# EAGLE schematic LKS2024_ESP_ACController_v66 (EAGLE 9.7.0)

## Sheet 1 of 5
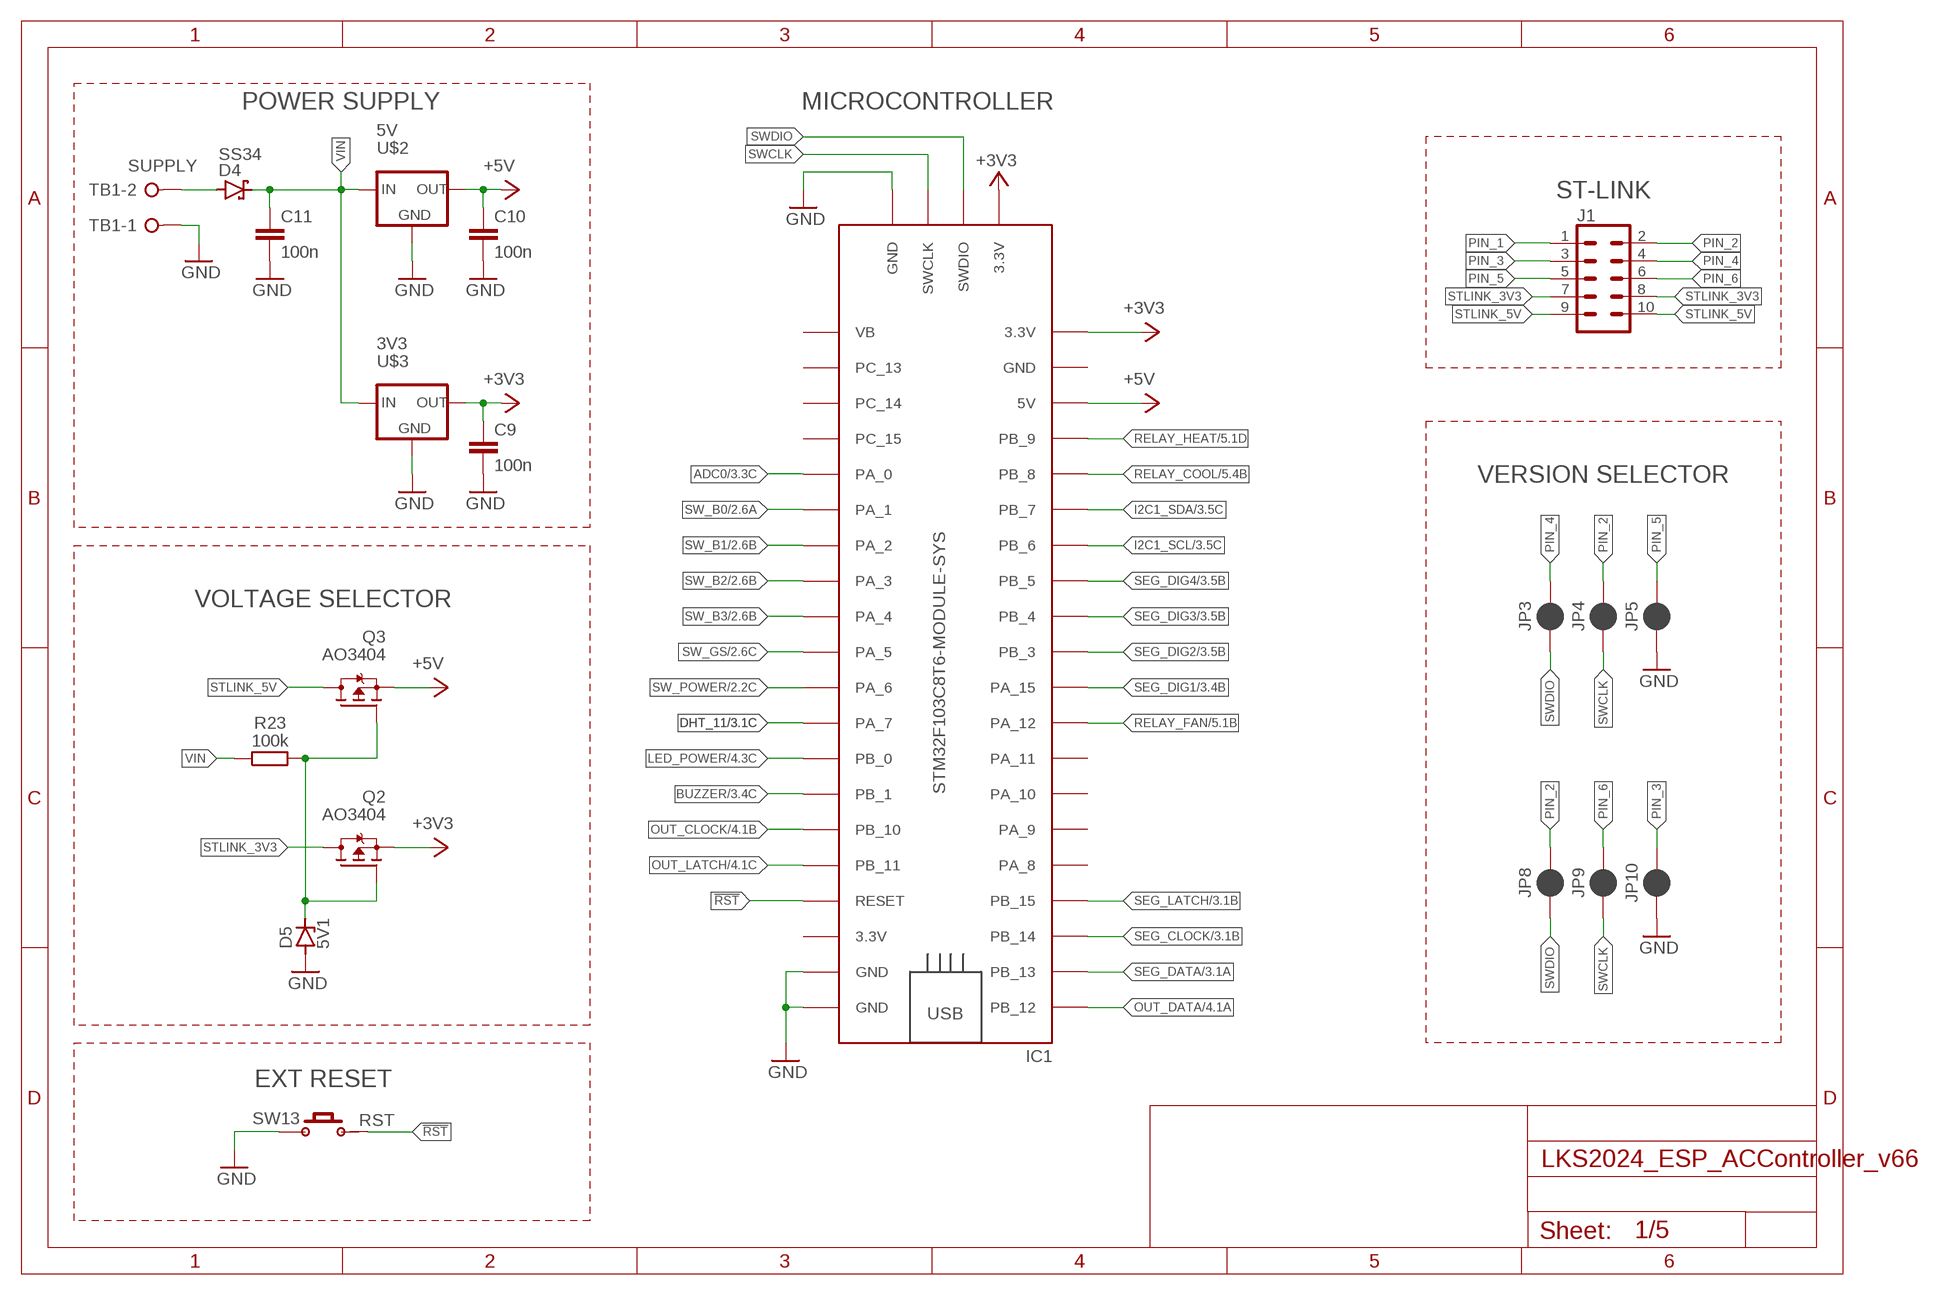
[diagram p0: schematic, sheet 1]

### Parts
C9  100n  C-EUC0805  [C0805]
C10  100n  C-EUC0805  [C0805]
C11  100n  C-EUC0805  [C0805]
D4  SS34  SS34SMA  [SMA]
D5  5V1  ZENER-DIODESOD80C  [SOD80C]
IC1  STM32F103C8T6-MODULE-SYS  [STM32F103C8T6-MODULE-SYS]
J1  CONN_05X2ML10L  [ML10L]
JP3  JUMPER-SMT_2_NC_PASTE_SILK  [SMT-JUMPER_2_NC_PASTE_SILK]
JP4  JUMPER-SMT_2_NC_PASTE_SILK  [SMT-JUMPER_2_NC_PASTE_SILK]
JP5  JUMPER-SMT_2_NC_PASTE_SILK  [SMT-JUMPER_2_NC_PASTE_SILK]
JP8  JUMPER-SMT_2_NC_PASTE_SILK  [SMT-JUMPER_2_NC_PASTE_SILK]
JP9  JUMPER-SMT_2_NC_PASTE_SILK  [SMT-JUMPER_2_NC_PASTE_SILK]
JP10  JUMPER-SMT_2_NC_PASTE_SILK  [SMT-JUMPER_2_NC_PASTE_SILK]
Q2  AO3404  [SOT23]
Q3  AO3404  [SOT23]
R23  100k  R-EU_R0805  [R0805]
SW13  RST  PUSH_BUTTON2P  [PUSH_BUTTON_2P]
TB1  SUPPLY  TERMINAL-BLOK-90  [MSTBA2]
U$2  5V  V_REG_LD1117VXXLD1117-SMD  [SOT223]
U$3  3V3  V_REG_LD1117VXXLD1117-SMD  [SOT223]

### Nets
!RST: IC1.RESET SW13.2
+3V3: C9.1 IC1.3.3V_1(3.3V) IC1.3V3_1(3.3V) IC1.3V3_3(3.3V) Q2.2(S) U$3.2(OUT) ; also sheet 2,3
+5V: C10.1 IC1.5V Q3.2(S) U$2.2(OUT) ; also sheet 3,4,5
ADC0: IC1.PA_0 ; also sheet 3
BUZZER: IC1.PB_1 ; also sheet 3
DHT_11: IC1.PA_7 ; also sheet 3
GND: C9.2 C10.2 C11.2 D5.A IC1.GND_2(GND) IC1.GND_3(GND) IC1.GND_4(GND) IC1.GND_5(GND) JP5.1 JP10.1 SW13.1 TB1.1 U$2.1(GND) U$3.1(GND) ; also sheet 2,3,4,5
I2C1_SCL: IC1.PB_6 ; also sheet 3
I2C1_SDA: IC1.PB_7 ; also sheet 3
LED_POWER: IC1.PB_0 ; also sheet 4
N$54: D4.A TB1.2
N$55: D5.C Q2.1(G) Q3.1(G) R23.2
OUT_CLOCK: IC1.PB_10 ; also sheet 4
OUT_DATA: IC1.PB_12 ; also sheet 4
OUT_LATCH: IC1.PB_11 ; also sheet 4
PIN_1: J1.1
PIN_2: J1.2 JP4.2 JP8.2
PIN_3: J1.3 JP10.2
PIN_4: J1.4 JP3.2
PIN_5: J1.5 JP5.2
PIN_6: J1.6 JP9.2
RELAY_COOL: IC1.PB_8 ; also sheet 5
RELAY_FAN: IC1.PA_12 ; also sheet 5
RELAY_HEAT: IC1.PB_9 ; also sheet 5
SEG_CLOCK: IC1.PB_14 ; also sheet 3
SEG_DATA: IC1.PB_13 ; also sheet 3
SEG_DIG1: IC1.PA_15 ; also sheet 3
SEG_DIG2: IC1.PB_3 ; also sheet 3
SEG_DIG3: IC1.PB_4 ; also sheet 3
SEG_DIG4: IC1.PB_5 ; also sheet 3
SEG_LATCH: IC1.PB_15 ; also sheet 3
STLINK_3V3: J1.7 J1.8 Q2.3(D)
STLINK_5V: J1.9 J1.10 Q3.3(D)
SW_B0: IC1.PA_1 ; also sheet 2
SW_B1: IC1.PA_2 ; also sheet 2
SW_B2: IC1.PA_3 ; also sheet 2
SW_B3: IC1.PA_4 ; also sheet 2
SW_GS: IC1.PA_5 ; also sheet 2
SW_POWER: IC1.PA_6 ; also sheet 2
SWCLK: IC1.SWCLK IC1.SWCLK1(SWCLK) JP4.1 JP9.1
SWDIO: IC1.SWDIO IC1.SWDIO1(SWDIO) JP3.1 JP8.1
VIN: C11.1 D4.C R23.1 U$2.3(IN) U$3.3(IN)
Unconnected: IC1.3.3V_2(3.3V) IC1.GND_1(GND) IC1.PA_8 IC1.PA_9 IC1.PA_10 IC1.PA_11 IC1.PC_13 IC1.PC_14 IC1.PC_15 IC1.VB

### Notes on the sheet
- POWER SUPPLY | MICROCONTROLLER
- ST-LINK
- VERSION SELECTOR
- VOLTAGE SELECTOR
- EXT RESET

## Sheet 2 of 5
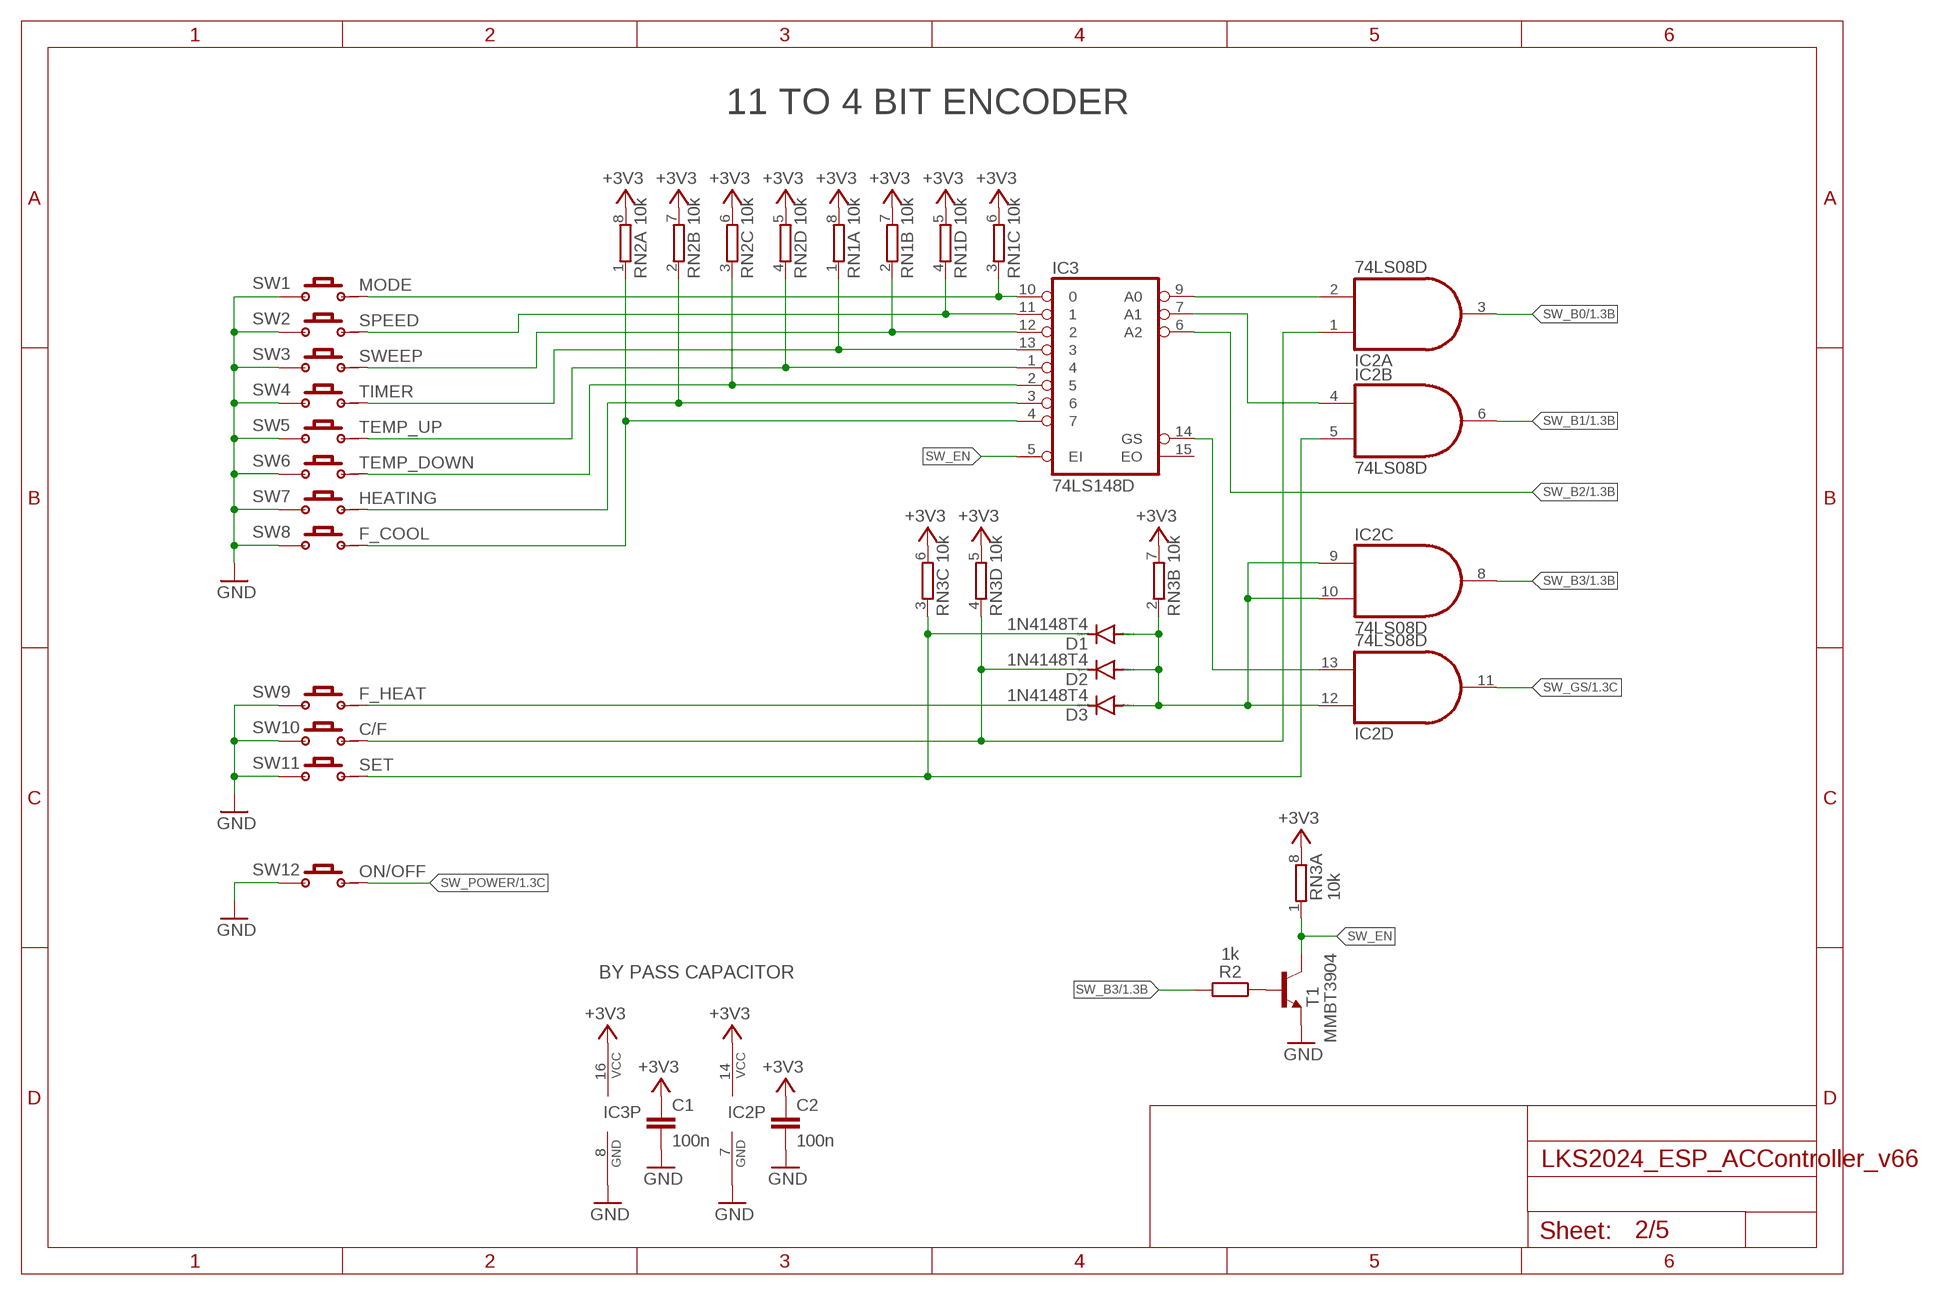
[diagram p1: schematic, sheet 2]

### Parts
C1  100n  C-EUC0805  [C0805]
C2  100n  C-EUC0805  [C0805]
D1  1N4148T4  [SOD123]
D2  1N4148T4  [SOD123]
D3  1N4148T4  [SOD123]
IC2  74LS08D  [SO14]
IC3  74LS148D  [SO16]
R2  1k  R-EU_R0805  [R0805]
RN1  10k  4R-N0603-ARC  [0603-ARC]
RN2  10k  4R-N0603-ARC  [0603-ARC]
RN3  10k  4R-N0603-ARC  [0603-ARC]
SW1  MODE  PUSH_BUTTON2P  [PUSH_BUTTON_2P]
SW2  SPEED  PUSH_BUTTON2P  [PUSH_BUTTON_2P]
SW3  SWEEP  PUSH_BUTTON2P  [PUSH_BUTTON_2P]
SW4  TIMER  PUSH_BUTTON2P  [PUSH_BUTTON_2P]
SW5  TEMP_UP  PUSH_BUTTON2P  [PUSH_BUTTON_2P]
SW6  TEMP_DOWN  PUSH_BUTTON2P  [PUSH_BUTTON_2P]
SW7  HEATING  PUSH_BUTTON2P  [PUSH_BUTTON_2P]
SW8  F_COOL  PUSH_BUTTON2P  [PUSH_BUTTON_2P]
SW9  F_HEAT  PUSH_BUTTON2P  [PUSH_BUTTON_2P]
SW10  C/F  PUSH_BUTTON2P  [PUSH_BUTTON_2P]
SW11  SET  PUSH_BUTTON2P  [PUSH_BUTTON_2P]
SW12  ON/OFF  PUSH_BUTTON2P  [PUSH_BUTTON_2P]
T1  MMBT3904  MMBT3904SOT23-BEC  [SOT23-BEC]

### Nets
+3V3: C1.1 C2.1 IC2.14(P:VCC) IC3.16(VCC) RN1.5 RN1.6 RN1.7 RN1.8 RN2.5 RN2.6 RN2.7 RN2.8 RN3.5 RN3.6 RN3.7 RN3.8 ; also sheet 1,3
GND: C1.2 C2.2 IC2.7(P:GND) IC3.8(GND) SW1.1 SW2.1 SW3.1 SW4.1 SW5.1 SW6.1 SW7.1 SW8.1 SW9.1 SW10.1 SW11.1 SW12.1 T1.E ; also sheet 1,3,4,5
N$1: IC2.2(A:I1) IC3.9(A0)
N$2: IC2.4(B:I0) IC3.7(A1)
N$3: IC2.13(D:I1) IC3.14(GS)
N$4: D1.A D2.A D3.A IC2.9(C:I0) IC2.10(C:I1) IC2.12(D:I0) RN3.2
N$5: IC3.10 RN1.3 SW1.2
N$6: IC3.11 RN1.4 SW2.2
N$7: IC3.12 RN1.2 SW3.2
N$8: IC3.13 RN1.1 SW4.2
N$9: IC3.1 RN2.4 SW5.2
N$10: IC3.2 RN2.3 SW6.2
N$11: IC3.3 RN2.2 SW7.2
N$12: IC3.4 RN2.1 SW8.2
N$13: D3.C SW9.2
N$14: D2.C IC2.1(A:I0) RN3.4 SW10.2
N$15: D1.C IC2.5(B:I1) RN3.3 SW11.2
N$17: R2.1 T1.B
SW_B0: IC2.3(A:O) ; also sheet 1
SW_B1: IC2.6(B:O) ; also sheet 1
SW_B2: IC3.6(A2) ; also sheet 1
SW_B3: IC2.8(C:O) R2.2 ; also sheet 1
SW_EN: IC3.5(EI) RN3.1 T1.C
SW_GS: IC2.11(D:O) ; also sheet 1
SW_POWER: SW12.2 ; also sheet 1
Unconnected: IC3.15(EO)

### Notes on the sheet
- 11 TO 4 BIT ENCODER
- BY PASS CAPACITOR

## Sheet 3 of 5
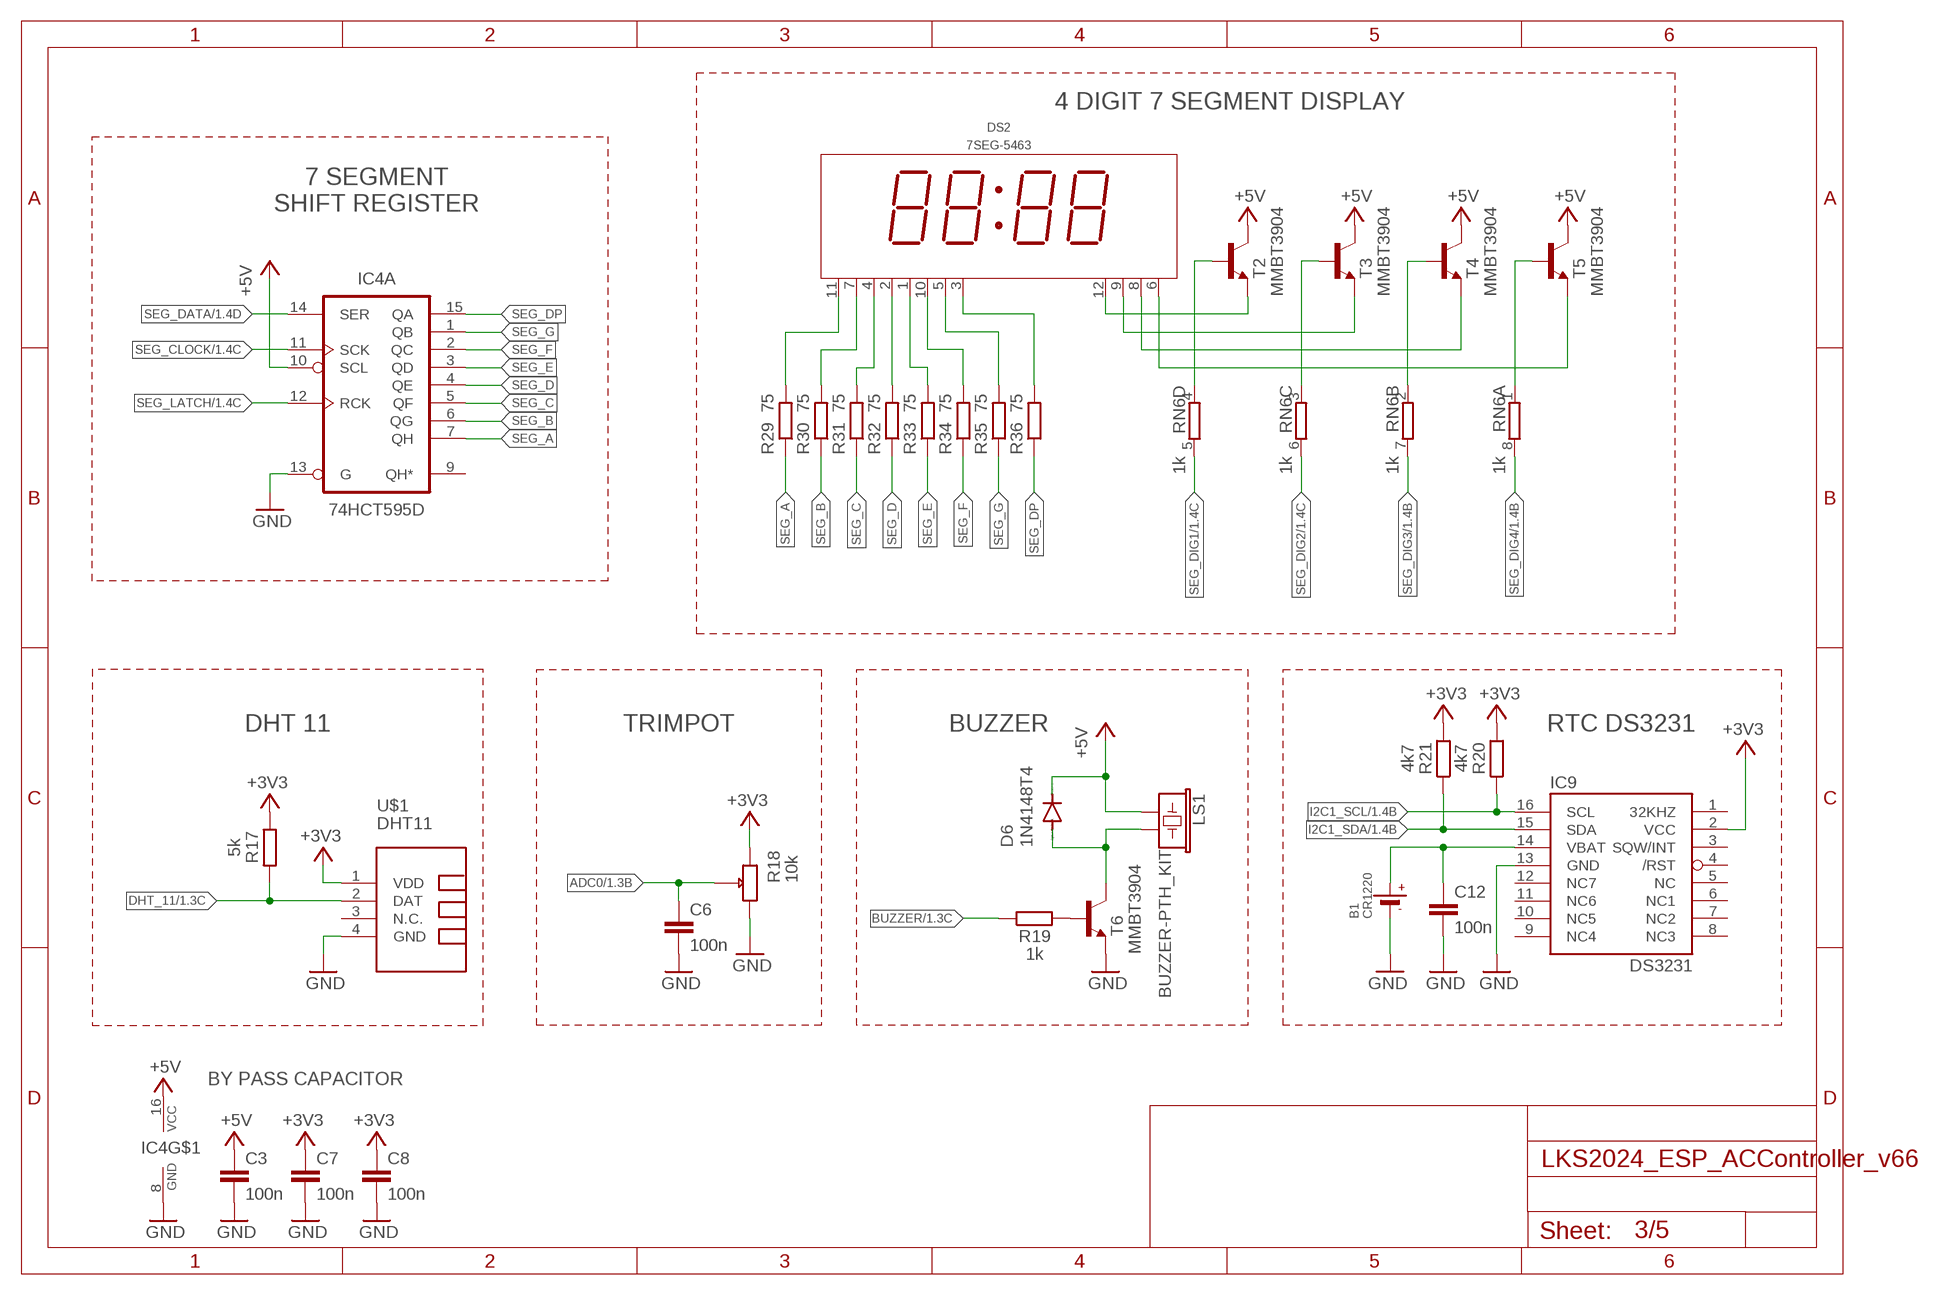
[diagram p2: schematic, sheet 3]

### Parts
B1  CR1220  BATTERY  [CR1220]
C3  100n  C-EUC0805  [C0805]
C6  100n  C-EUC0805  [C0805]
C7  100n  C-EUC0805  [C0805]
C8  100n  C-EUC0805  [C0805]
C12  100n  C-EUC0805  [C0805]
D6  1N4148T4  [SOD123]
DS2  7SEG-5463  [5643]
IC4  74HCT595D  [SO16]
IC9  DS3231"  [SO16W]
LS1  BUZZER-PTH_KIT  [BUZZER-12MM-KIT]
R17  5k  R-EU_R0805  [R0805]
R18  10k  3386P-1-101T  [TRIM_3386P-1-101T]
R19  1k  R-EU_R0805  [R0805]
R20  4k7  R-EU_R0805  [R0805]
R21  4k7  R-EU_R0805  [R0805]
R29  75  R-EU_R0603  [R0603]
R30  75  R-EU_R0603  [R0603]
R31  75  R-EU_R0603  [R0603]
R32  75  R-EU_R0603  [R0603]
R33  75  R-EU_R0603  [R0603]
R34  75  R-EU_R0603  [R0603]
R35  75  R-EU_R0603  [R0603]
R36  75  R-EU_R0603  [R0603]
RN6  1k  4R-N0603-ARC  [0603-ARC]
T2  MMBT3904  MMBT3904SOT23-BEC  [SOT23-BEC]
T3  MMBT3904  MMBT3904SOT23-BEC  [SOT23-BEC]
T4  MMBT3904  MMBT3904SOT23-BEC  [SOT23-BEC]
T5  MMBT3904  MMBT3904SOT23-BEC  [SOT23-BEC]
T6  MMBT3904  MMBT3904SOT23-BEC  [SOT23-BEC]
U$1  DHT11  TEMP-HUM-SENSOR-DHT11H  [DHT11]

### Nets
+3V3: C7.1 C8.1 IC9.2(VCC) R17.1 R18.3(CW) R20.2 R21.2 U$1.1(VDD) ; also sheet 1,2
+5V: C3.1 D6.C IC4.10(A:SCL) IC4.16(VCC) LS1.+\ T2.C T3.C T4.C T5.C ; also sheet 1,4,5
ADC0: C6.1 R18.2(WIPER) ; also sheet 1
BUZZER: R19.1 ; also sheet 1
DHT_11: R17.2 U$1.2(DAT) ; also sheet 1
GND: B1.- C3.2 C6.2 C7.2 C8.2 C12.2 IC4.8(GND) IC4.13(A:G) IC9.13(GND) R18.1(CCW) T6.E U$1.4(GND) ; also sheet 1,2,4,5
I2C1_SCL: IC9.16(SCL) R20.1 ; also sheet 1
I2C1_SDA: IC9.15(SDA) R21.1 ; also sheet 1
N$18: DS2.12(DIG1) T2.E
N$19: DS2.11(A) R29.2
N$20: DS2.7(B) R30.2
N$21: DS2.4(C) R31.2
N$22: DS2.2(D) R32.2
N$23: DS2.1(E) R33.2
N$24: DS2.10(F) R34.2
N$25: DS2.5(G) R35.2
N$26: DS2.3(H) R36.2
N$27: RN6.4 T2.B
N$28: DS2.9(DIG2) T3.E
N$29: DS2.8(DIG3) T4.E
N$30: DS2.6(DIG4) T5.E
N$31: RN6.3 T3.B
N$32: RN6.2 T4.B
N$33: RN6.1 T5.B
N$50: D6.A LS1.- T6.C
N$51: R19.2 T6.B
N$52: B1.+ C12.1 IC9.14(VBAT)
SEG_A: IC4.7(A:QH) R29.1
SEG_B: IC4.6(A:QG) R30.1
SEG_C: IC4.5(A:QF) R31.1
SEG_CLOCK: IC4.11(A:SCK) ; also sheet 1
SEG_D: IC4.4(A:QE) R32.1
SEG_DATA: IC4.14(A:SER) ; also sheet 1
SEG_DIG1: RN6.5 ; also sheet 1
SEG_DIG2: RN6.6 ; also sheet 1
SEG_DIG3: RN6.7 ; also sheet 1
SEG_DIG4: RN6.8 ; also sheet 1
SEG_DP: IC4.15(A:QA) R36.1
SEG_E: IC4.3(A:QD) R33.1
SEG_F: IC4.2(A:QC) R34.1
SEG_G: IC4.1(A:QB) R35.1
SEG_LATCH: IC4.12(A:RCK) ; also sheet 1
Unconnected: IC4.9(A:QH*) IC9.1(32KHZ) IC9.3(SQW/INT) IC9.4(/RST) IC9.5(NC) IC9.6(NC1) IC9.7(NC2) IC9.8(NC3) IC9.9(NC4) IC9.10(NC5) IC9.11(NC6) IC9.12(NC7) U$1.3(N.C.)

### Notes on the sheet
- 4 DIGIT 7 SEGMENT DISPLAY
- 7 SEGMENT
  SHIFT REGISTER
- DHT 11 | TRIMPOT | BUZZER | RTC DS3231
- BY PASS CAPACITOR

## Sheet 4 of 5
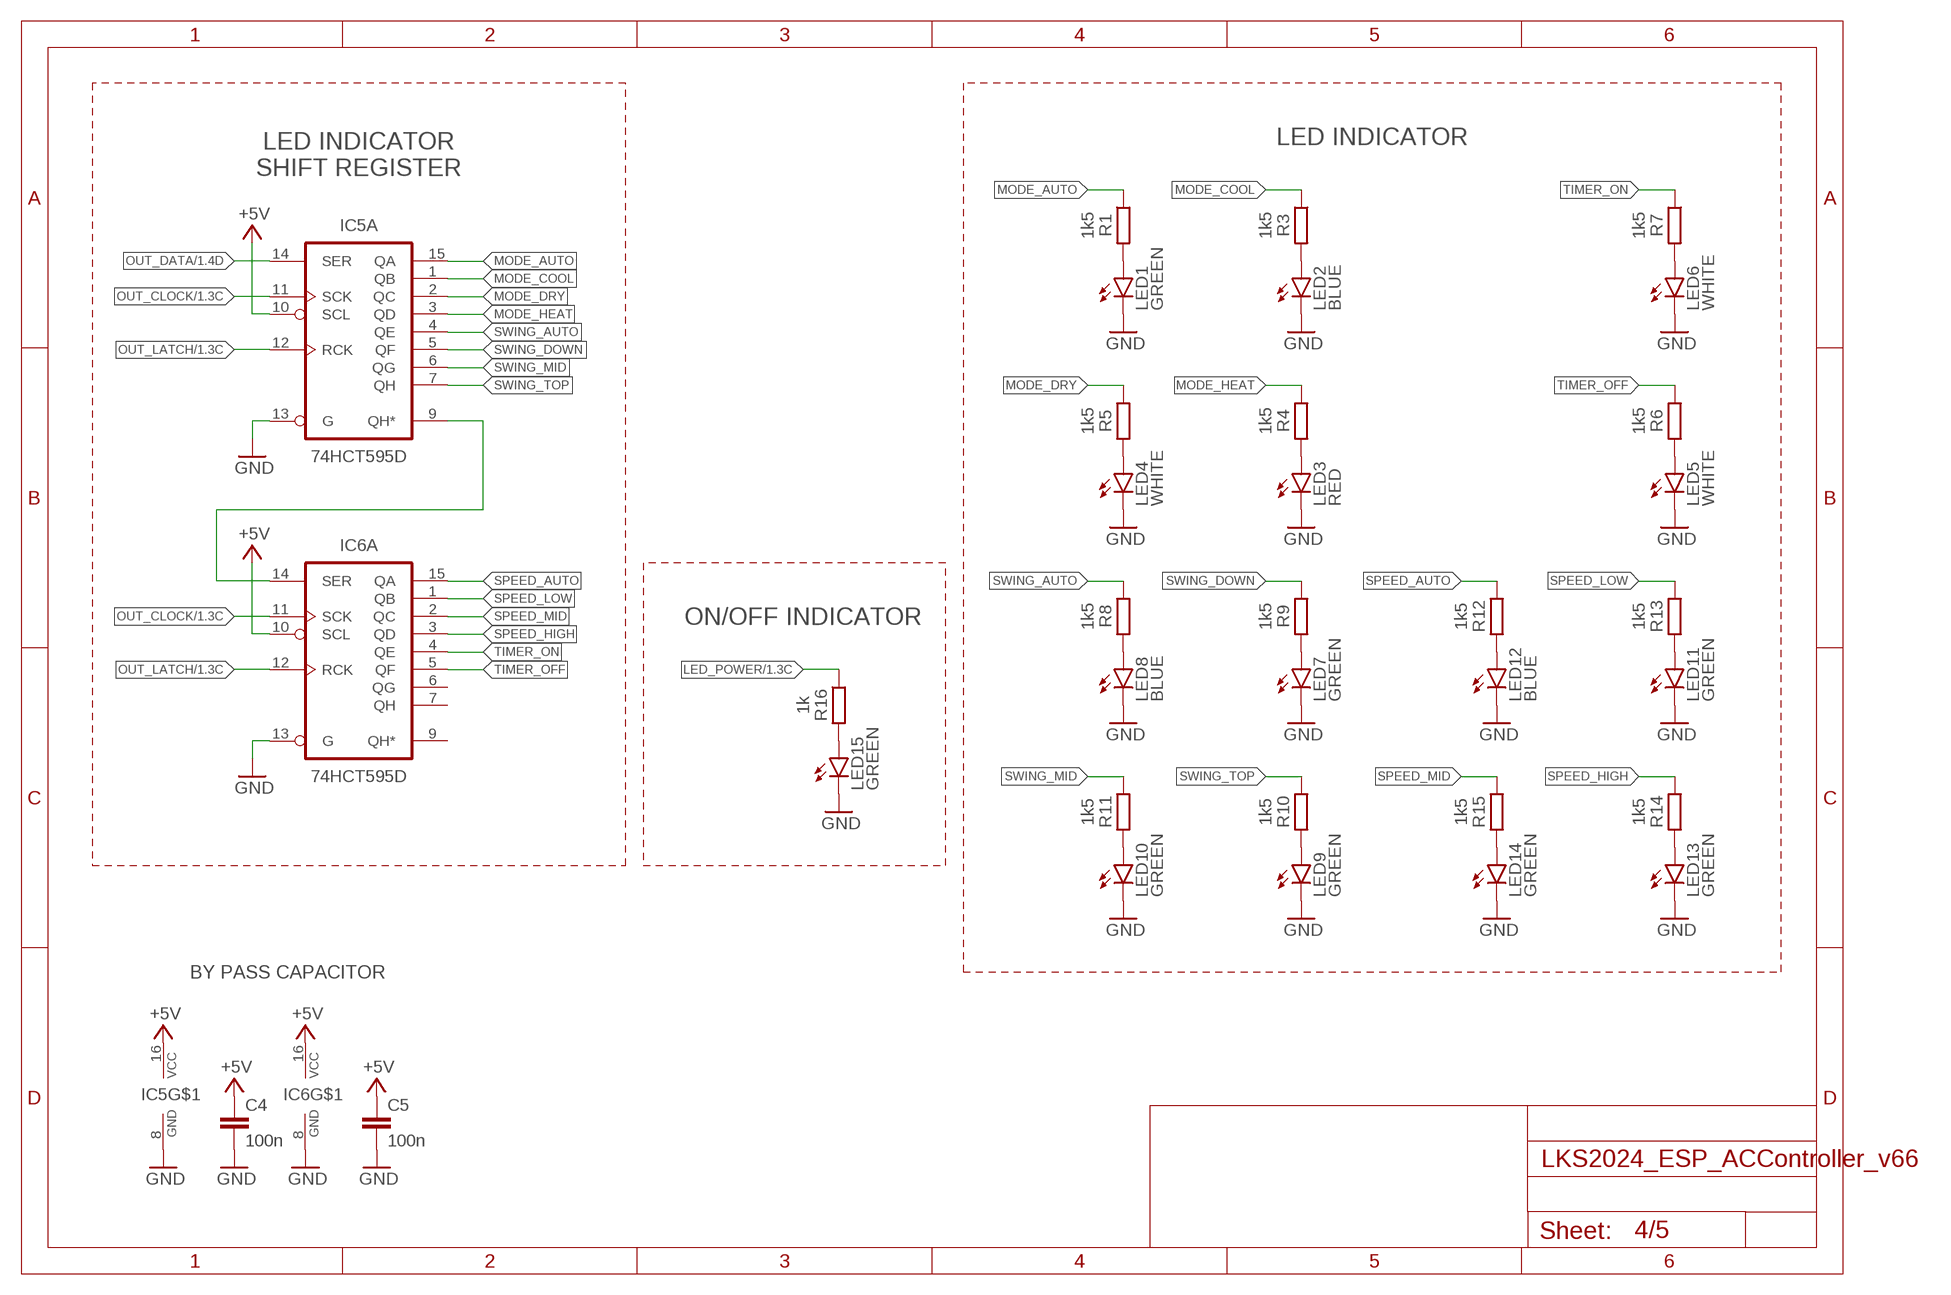
[diagram p3: schematic, sheet 4]

### Parts
C4  100n  C-EUC0805  [C0805]
C5  100n  C-EUC0805  [C0805]
IC5  74HCT595D  [SO16]
IC6  74HCT595D  [SO16]
LED1  GREEN  LEDCHIPLED_1206  [CHIPLED_1206]
LED2  BLUE  LEDCHIPLED_1206  [CHIPLED_1206]
LED3  RED  LEDCHIPLED_1206  [CHIPLED_1206]
LED4  WHITE  LEDCHIPLED_1206  [CHIPLED_1206]
LED5  WHITE  LEDCHIPLED_1206  [CHIPLED_1206]
LED6  WHITE  LEDCHIPLED_1206  [CHIPLED_1206]
LED7  GREEN  LEDCHIPLED_1206  [CHIPLED_1206]
LED8  BLUE  LEDCHIPLED_1206  [CHIPLED_1206]
LED9  GREEN  LEDCHIPLED_1206  [CHIPLED_1206]
LED10  GREEN  LEDCHIPLED_1206  [CHIPLED_1206]
LED11  GREEN  LEDCHIPLED_1206  [CHIPLED_1206]
LED12  BLUE  LEDCHIPLED_1206  [CHIPLED_1206]
LED13  GREEN  LEDCHIPLED_1206  [CHIPLED_1206]
LED14  GREEN  LEDCHIPLED_1206  [CHIPLED_1206]
LED15  GREEN  LEDCHIPLED_1206  [CHIPLED_1206]
R1  1k5  R-EU_R0805  [R0805]
R3  1k5  R-EU_R0805  [R0805]
R4  1k5  R-EU_R0805  [R0805]
R5  1k5  R-EU_R0805  [R0805]
R6  1k5  R-EU_R0805  [R0805]
R7  1k5  R-EU_R0805  [R0805]
R8  1k5  R-EU_R0805  [R0805]
R9  1k5  R-EU_R0805  [R0805]
R10  1k5  R-EU_R0805  [R0805]
R11  1k5  R-EU_R0805  [R0805]
R12  1k5  R-EU_R0805  [R0805]
R13  1k5  R-EU_R0805  [R0805]
R14  1k5  R-EU_R0805  [R0805]
R15  1k5  R-EU_R0805  [R0805]
R16  1k  R-EU_R0805  [R0805]

### Nets
+5V: C4.1 C5.1 IC5.10(A:SCL) IC5.16(VCC) IC6.10(A:SCL) IC6.16(VCC) ; also sheet 1,3,5
GND: C4.2 C5.2 IC5.8(GND) IC5.13(A:G) IC6.8(GND) IC6.13(A:G) LED1.C LED2.C LED3.C LED4.C LED5.C LED6.C LED7.C LED8.C LED9.C LED10.C LED11.C LED12.C LED13.C LED14.C LED15.C ; also sheet 1,2,3,5
LED_POWER: R16.1 ; also sheet 1
MODE_AUTO: IC5.15(A:QA) R1.1
MODE_COOL: IC5.1(A:QB) R3.1
MODE_DRY: IC5.2(A:QC) R5.1
MODE_HEAT: IC5.3(A:QD) R4.1
N$34: IC5.9(A:QH*) IC6.14(A:SER)
N$35: LED1.A R1.2
N$36: LED2.A R3.2
N$37: LED3.A R4.2
N$38: LED4.A R5.2
N$39: LED5.A R6.2
N$40: LED6.A R7.2
N$41: LED8.A R8.2
N$42: LED7.A R9.2
N$43: LED9.A R10.2
N$44: LED10.A R11.2
N$45: LED12.A R12.2
N$46: LED11.A R13.2
N$47: LED13.A R14.2
N$48: LED14.A R15.2
N$49: LED15.A R16.2
OUT_CLOCK: IC5.11(A:SCK) IC6.11(A:SCK) ; also sheet 1
OUT_DATA: IC5.14(A:SER) ; also sheet 1
OUT_LATCH: IC5.12(A:RCK) IC6.12(A:RCK) ; also sheet 1
SPEED_AUTO: IC6.15(A:QA) R12.1
SPEED_HIGH: IC6.3(A:QD) R14.1
SPEED_LOW: IC6.1(A:QB) R13.1
SPEED_MID: IC6.2(A:QC) R15.1
SWING_AUTO: IC5.4(A:QE) R8.1
SWING_DOWN: IC5.5(A:QF) R9.1
SWING_MID: IC5.6(A:QG) R11.1
SWING_TOP: IC5.7(A:QH) R10.1
TIMER_OFF: IC6.5(A:QF) R6.1
TIMER_ON: IC6.4(A:QE) R7.1
Unconnected: IC6.6(A:QG) IC6.7(A:QH) IC6.9(A:QH*)

### Notes on the sheet
- LED INDICATOR
- LED INDICATOR
  SHIFT REGISTER
- ON/OFF INDICATOR
- BY PASS CAPACITOR

## Sheet 5 of 5
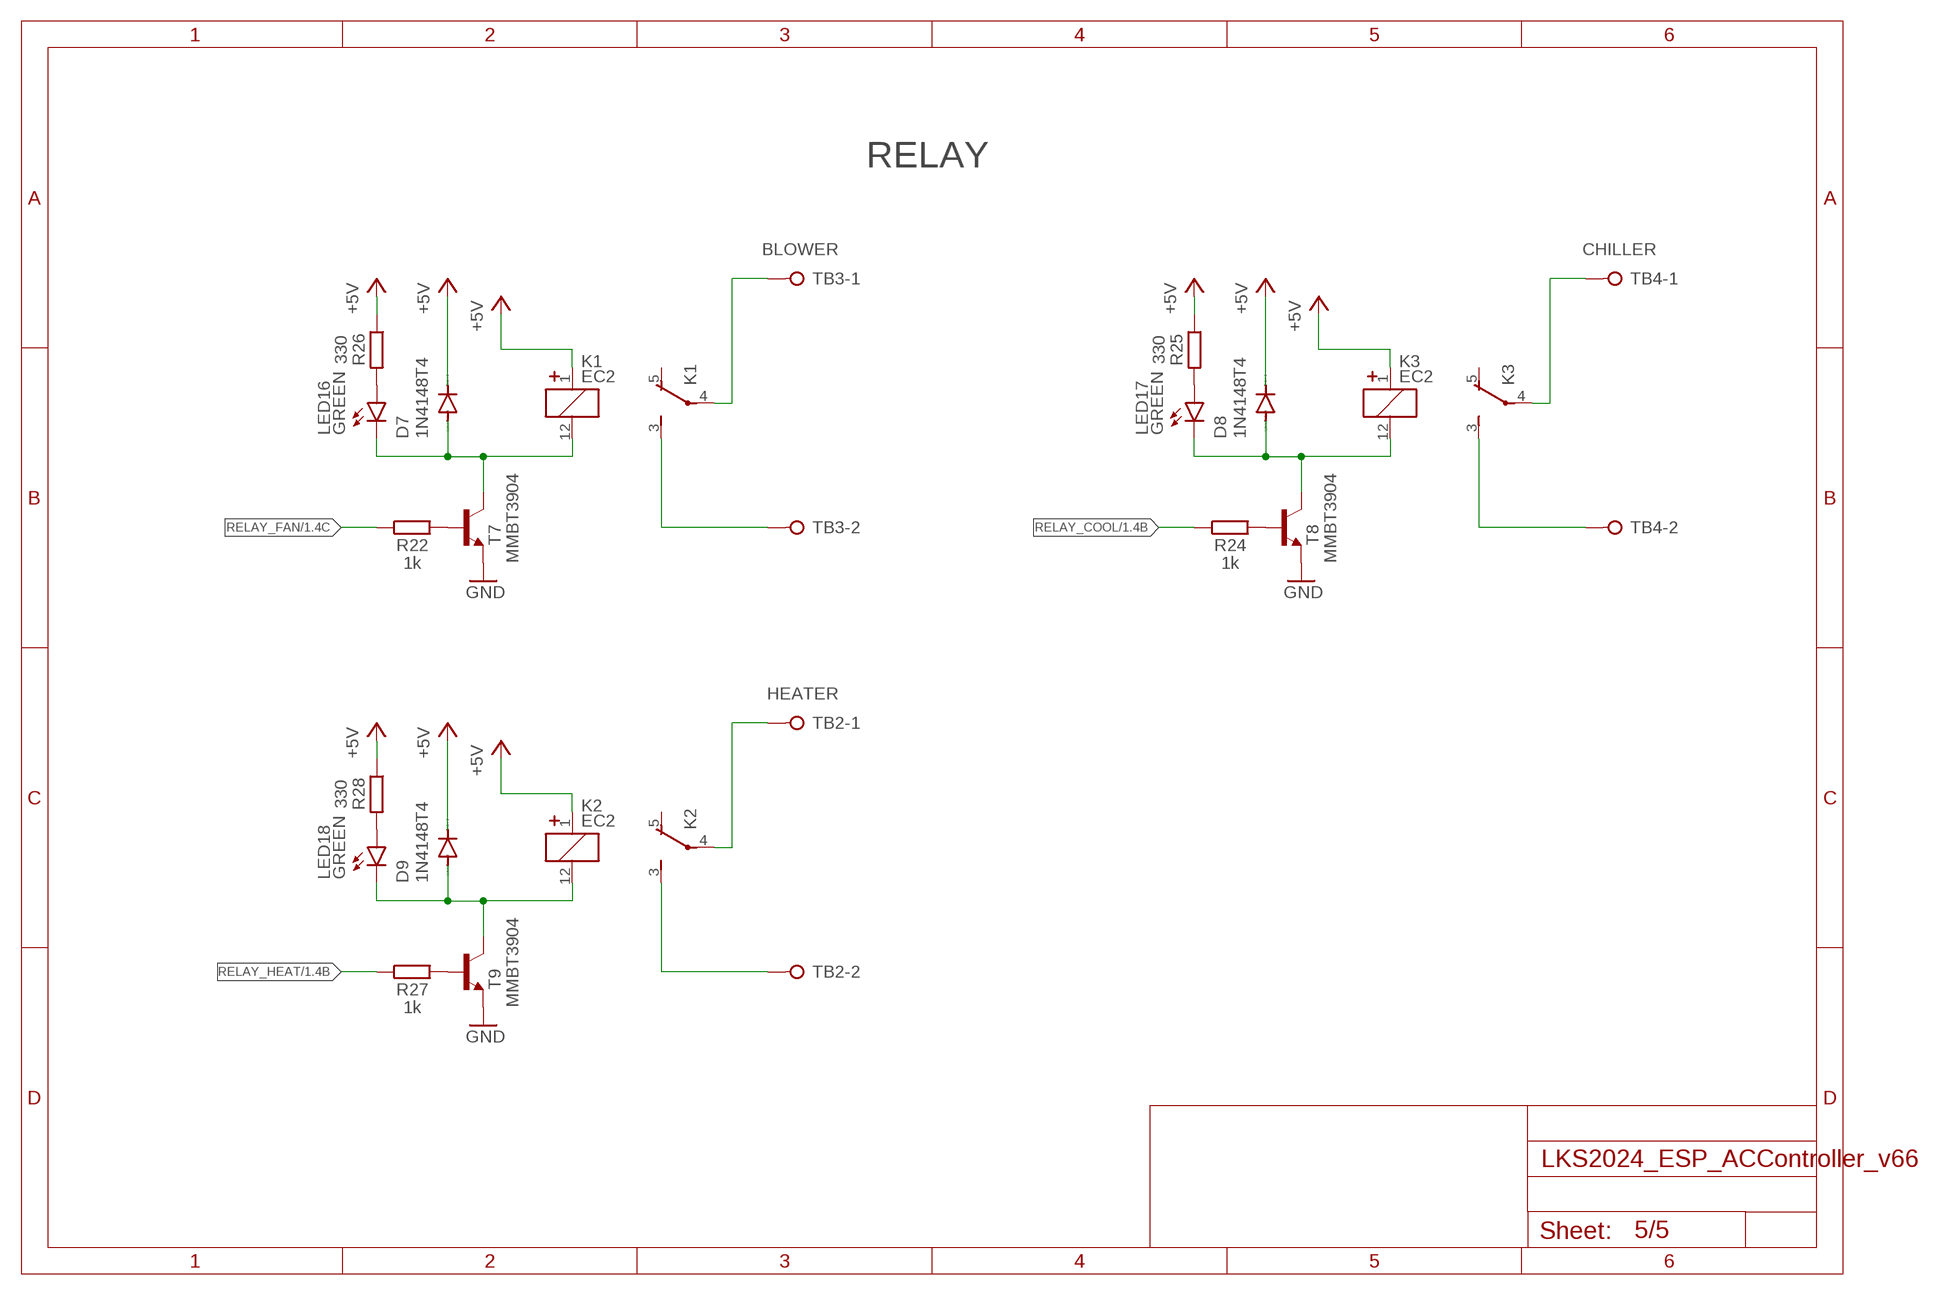
[diagram p4: schematic, sheet 5]

### Parts
D7  1N4148T4  [SOD123]
D8  1N4148T4  [SOD123]
D9  1N4148T4  [SOD123]
K1  EC2  [EC2]
K2  EC2  [EC2]
K3  EC2  [EC2]
LED16  GREEN  LEDCHIPLED_1206  [CHIPLED_1206]
LED17  GREEN  LEDCHIPLED_1206  [CHIPLED_1206]
LED18  GREEN  LEDCHIPLED_1206  [CHIPLED_1206]
R22  1k  R-EU_R0805  [R0805]
R24  1k  R-EU_R0805  [R0805]
R25  330  R-EU_R0805  [R0805]
R26  330  R-EU_R0805  [R0805]
R27  1k  R-EU_R0805  [R0805]
R28  330  R-EU_R0805  [R0805]
T7  MMBT3904  MMBT3904SOT23-BEC  [SOT23-BEC]
T8  MMBT3904  MMBT3904SOT23-BEC  [SOT23-BEC]
T9  MMBT3904  MMBT3904SOT23-BEC  [SOT23-BEC]
TB2  HEATER  TERMINAL-BLOK-90  [MSTBA2]
TB3  BLOWER  TERMINAL-BLOK-90  [MSTBA2]
TB4  CHILLER  TERMINAL-BLOK-90  [MSTBA2]

### Nets
+5V: D7.C D8.C D9.C K1.1(1+) K2.1(1+) K3.1(1+) R25.1 R26.1 R28.1 ; also sheet 1,3,4
GND: T7.E T8.E T9.E ; also sheet 1,2,3,4
N$57: D7.A K1.12(2-) LED16.C T7.C
N$58: R22.2 T7.B
N$59: D8.A K3.12(2-) LED17.C T8.C
N$60: R24.2 T8.B
N$61: LED17.A R25.2
N$62: K3.3(S) TB4.2
N$63: LED16.A R26.2
N$64: K1.3(S) TB3.2
N$65: K1.4(P) TB3.1
N$66: K3.4(P) TB4.1
N$67: D9.A K2.12(2-) LED18.C T9.C
N$68: R27.2 T9.B
N$69: LED18.A R28.2
N$70: K2.3(S) TB2.2
N$71: K2.4(P) TB2.1
RELAY_COOL: R24.1 ; also sheet 1
RELAY_FAN: R22.1 ; also sheet 1
RELAY_HEAT: R27.1 ; also sheet 1
Unconnected: K1.5(O) K1.8(O) K1.9(P) K1.10(S) K2.5(O) K2.8(O) K2.9(P) K2.10(S) K3.5(O) K3.8(O) K3.9(P) K3.10(S)

### Notes on the sheet
- RELAY

## Library data of the parts
B1 = Khoirul-Connector:BATTERY
C1-C12 = Khoirul-RCL:C-EU: CAPACITOR, European symbol; SPICEPREFIX: C
D1-D3 D6-D9 = Khoirul-Diode:1N4148: DIODE high speed (Philips)
D4 = Khoirul-Component:SS34: SCHOTTKY BARRIER RECTIFIER 3.0 AMPERES 20, 30, 40 VOLT Source: MBRS340T3-D.pdf
D5 = Khoirul-Diode:ZENER-DIODE: Z-Diode
DS2 = Khoirul-Display:7SEG-5463
IC1 = Khoirul-diy-module:STM32F103C8T6-MODULE-SYS: STM32F103C8T6 module with ARM Cortex-3, 20kB SRAM, 64kB Flash, 72MHz
IC2 = 74xx-us:74*08: Quad 2-input AND gate
IC3 = 74xx-us:74*148: 10-line to 4-line and 8-line to 3-line PRIORITY ENCODER
IC4-IC6 = Khoirul-Component:74*595: 8-bit SHIFT REGISTER, output latch; CATEGORY: IC_Logic; SUB-CATEGORY: Shift Register
IC9 = Khoirul-Component:DS3231
J1 = Khoirul-Connector:CONN_05X2: Multi connection point. Often used as Generic Header-pin footprint for 0.1 inch spaced/style header connections For AVR SPI programming port, see special device with nice symbol: "AVR_SPI_PROG_5x2.dev" You can populate with any combo of single row headers, but if you'd like an exact match, check these: 2x5 AVR ICSP Male Header <https://www.sparkfun.com/products/778> (PRT-00778) 2x5 Pin Shrouded Header <https://www.sparkfun.com/products/8506> (PRT-08506) On any of the 0.1 inch spaced packages, you can populate with these: Break Away Headers - Straight <https://www.sparkfun.com/products/116> (PRT-00116) Break Away Male Headers - Right Angle <https://www.sparkfun.com/products/553> (PRT-00553) Female Headers <https://www.sparkfun.com/products/115> (PRT-00115) Break Away Headers - Machine Pin <https://www.sparkfun.com/products/117> (PRT-00117) Break Away Female Headers - Swiss Machine Pin <https://www.sparkfun.com/products/743> (PRT-00743) Special note: the shrouded connector mates well with our 5x2 ribbon cables: 2x5 Pin IDC Ribbon Cable <https://www.sparkfun.com/products/8535> (PRT-08535)
JP3-JP5 JP8-JP10 = SparkFun-Jumpers:JUMPER-SMT_2_NC_PASTE: Normally closed solder jumper This jumper has an aperture in the stencil to allow solder paste to bridge the split in the wire so it's normally closed (NC). Wick off the solder to open the connection. Reapply solder to reclose the connection.
K1-K3 = Khoirul-Component:EC2
LED1-LED18 = Khoirul-Component:LED: LED OSRAM: - CHIPLED LG R971, LG N971, LY N971, LG Q971, LY Q971, LO R971, LY R971 LH N974, LH R974 LS Q976, LO Q976, LY Q976 LO Q996 - Hyper CHIPLED LW Q18S LB Q993, LB Q99A, LB R99A - SideLED LS A670, LO A670, LY A670, LG A670, LP A670 LB A673, LV A673, LT A673, LW A673 LH A674 LY A675 LS A676, LA A676, LO A676, LY A676, LW A676 LS A679, LY A679, LG A679 - Hyper Micro SIDELED® LS Y876, LA Y876, LO Y876, LY Y876 LT Y87S - SmartLED LW L88C, LW L88S LB L89C, LB L89S, LG L890 LS L89K, LO L89K, LY L89K LS L896, LA L896, LO L896, LY L896 - TOPLED LS T670, LO T670, LY T670, LG T670, LP T670 LSG T670, LSP T670, LSY T670, LOP T670, LYG T670 LG T671, LOG T671, LSG T671 LB T673, LV T673, LT T673, LW T673 LH T674 LS T676, LA T676, LO T676, LY T676, LB T676, LH T676, LSB T676, LW T676 LB T67C, LV T67C, LT T67C, LS T67K, LO T67K, LY T67K, LW E67C LS E67B, LA E67B, LO E67B, LY E67B, LB E67C, LV E67C, LT E67C LW T67C LS T679, LY T679, LG T679 LS T770, LO T770, LY T770, LG T770, LP T770 LB T773, LV T773, LT T773, LW T773 LH T774 LS E675, LA E675, LY E675, LS T675 LS T776, LA T776, LO T776, LY T776, LB T776 LHGB T686 LT T68C, LB T68C - Hyper Mini TOPLED® LB M676 - Mini TOPLED Santana® LG M470 LS M47K, LO M47K, LY M47K Source: http://www.osram.convergy.de LUXEON: - LUMILED® LXK2-PW12-R00, LXK2-PW12-S00, LXK2-PW14-U00, LXK2-PW14-V00 LXK2-PM12-R00, LXK2-PM12-S00, LXK2-PM14-U00 LXK2-PE12-Q00, LXK2-PE12-R00, LXK2-PE12-S00, LXK2-PE14-T00, LXK2-PE14-U00 LXK2-PB12-K00, LXK2-PB12-L00, LXK2-PB12-M00, LXK2-PB14-N00, LXK2-PB14-P00, LXK2-PB14-Q00 LXK2-PR12-L00, LXK2-PR12-M00, LXK2-PR14-Q00, LXK2-PR14-R00 LXK2-PD12-Q00, LXK2-PD12-R00, LXK2-PD12-S00 LXK2-PH12-R00, LXK2-PH12-S00 LXK2-PL12-P00, LXK2-PL12-Q00, LXK2-PL12-R00 Source: www.luxeon.com KINGBRIGHT: KA-3528ASYC Source: www.kingbright.com
LS1 = Khoirul-Component:BUZZER: Buzzer Small round buzzers that operate around the audible 2kHz range. You can use these as speakers to create simple music or user interfaces. Variant Overview: PTH - Mini Speaker - PC Mount 12mm 2.048kHz <https://www.sparkfun.com/products/7950> PTH_KIT - Mini Speaker - PC Mount 12mm 2.048kHz <https://www.sparkfun.com/products/7950> KIT simplifies soldering by adding stop mask to one side of the pads. PTH_NO_SILK - Mini Speaker - PC Mount 12mm 2.048kHz <https://www.sparkfun.com/products/7950> No silkscreen indicator of buzzer outline. PTH_KIT_NO_SILK - Mini Speaker - PC Mount 12mm 2.048kHz <https://www.sparkfun.com/products/7950> KIT package w/o silkscreen SMD - Buzzer Audio Magnetic (CCV-084B16) SMD buzzer used on, e.g. the LilyPad Buzzer <https://www.sparkfun.com/products/8463> and RFID USB Reader <https://www.sparkfun.com/products/9963>. SMD_KIT - Buzzer Audio Magnetic (CCV-084B16) SMD Buzzer with elongated pins to make soldering easier. Used on the SparkFun Simon Says - Surface Mount Soldering Kit <https://www.sparkfun.com/products/10935>.; PROD_ID: COMP-08253; SF_SKU: COM-07950
Q2 Q3 = Khoirul-Component:AO3404
R1-R17 R19-R36 = Khoirul-RCL:R-EU_: RESISTOR, European symbol; SPICEPREFIX: R
R18 = Khoirul-Component:3386P-1-101T: Check availability <https://pricing.snapeda.com/parts/3386P-1-101/Bourns/view-part?ref=eda>; AVAILABILITY: In Stock; CHECK_PRICES: https://www.snapeda.com/parts/3386P-1-101/Bourns/view-part/?ref=eda; DESCRIPTION: TRIMMER - 3/8in SQ ST CERMET | Bourns 3386P-1-101; MF: Bourns; MP: 3386P-1-101; PACKAGE: 3386P-3 Bourns; PRICE: None; SNAPEDA_LINK: https://www.snapeda.com/parts/3386P-1-101/Bourns/view-part/?ref=snap
RN1-RN3 RN6 = Khoirul-Component:4R-N: Array Chip Resistor Source: RS Component / Phycomp; OC_FARNELL: unknown; OC_NEWARK: unknown
SW1-SW13 = Khoirul-Component:PUSH_BUTTON
T1-T9 = Khoirul-Component:MMBT3904: NPN Transistror BF959 corrected 2008.03.06
TB1-TB4 = 000_LibraryUtama:TERMINAL-BLOK
U$1 = Khoirul-Component:TEMP-HUM-SENSOR-DHT11: DHT11 - digital humidity & temperature sensor DHT11 datasheet available here: https://akizukidenshi.com/download/ds/aosong/DHT11.pdf Click here to find device on ebay.com <http://www.ebay.com/sch/dht11+digital+sensor>
U$2 U$3 = SparkFun-IC-Power:V_REG_LD1117VXX: LD1117VXX voltage regulator. We carry the 3.3V version (COM-00526) in TO-220 package.; PROD_ID: VREG-13917